# EAGLE design ltr-390uv-01-breakout (EAGLE 9.6.2)
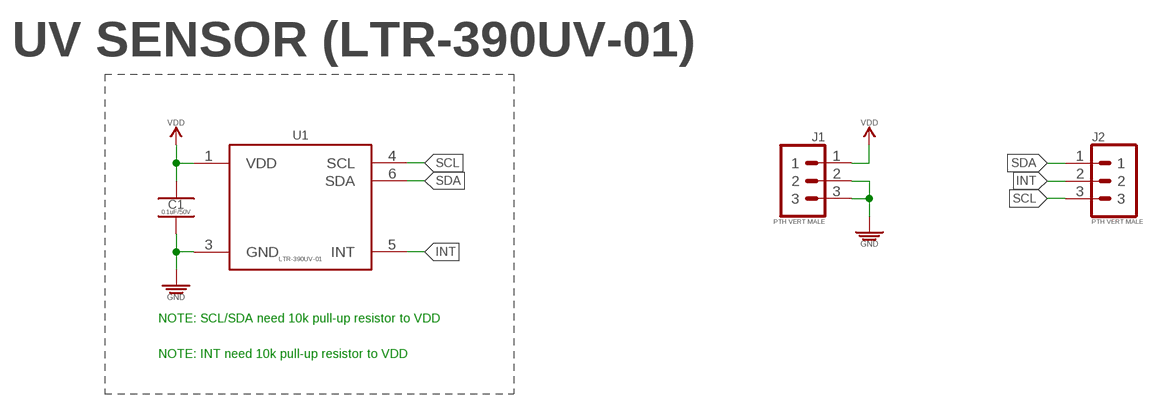
[diagram p0: schematic, sheet 1]

## Parts
C1  0.1uF/50V  0.1UF_SMD-0402_50V-10%  [CAPC1005X55_SMD-0402]
J1  PTH VERT MALE  1X03_PTH_VERT_MALE_2.54MM  [HDRV3W64P254_1X3_762X254X838B]
J2  PTH VERT MALE  1X03_PTH_VERT_MALE_2.54MM  [HDRV3W64P254_1X3_762X254X838B]
U1  LTR-390UV-01  [SON65P200X200X70-6N-LTR-390UV-01]

## Nets
GND: C1.2 J1.2 J1.3 U1.3(GND)
INT: J2.2 U1.5(INT)
SCL: J2.3 U1.4(SCL)
SDA: J2.1 U1.6(SDA)
VDD: C1.1 J1.1 U1.1(VDD)

## Notes on the sheet
- UV SENSOR (LTR-390UV-01)
- NOTE: SCL/SDA need 10k pull-up resistor to VDD
- NOTE: INT need 10k pull-up resistor to VDD

## Library data of the parts
C1 = _capacitors:0.1UF; DATASHEET: https://product.tdk.com/info/en/catalog/datasheets/mlcc_commercial_soft_en.pdf; DIST: Digikey; DISTLINK: https://www.digikey.com/products/en?keywords=445-173610-1-ND; DISTPN: 445-173610-1-ND; MFR: TDK Corporation; MPN: C1005X7R1H104K050BE
J1 J2 = _connectors:1X03; DATASHEET: https://s3.amazonaws.com/catalogspreads-pdf/PAGE112-113%20.100%20MALE%20HDR.pdf; DIST: Digikey; DISTLINK: https://www.digikey.com/en/products/detail/sullins-connector-solutions/PEC03SAAN/859156?s=N4IgTCBcDaIMoEYAMCwFEC0SDMGByAIiALoC%2BQA; DISTPN: S1012E-03-ND; MFR: Sullins Connector Solutions; MPN: PEC03SAAN
U1 = _sensors:LTR-390UV-01: SENSOR OPT ULTRAVIOLET 6PINS Optical Sensor Ultraviolet (UV) I²C 6-WFDFN; DATASHEET: https://optoelectronics.liteon.com/upload/download/DS86-2015-0004/LTR-390UV_Final_%20DS_V1%201.pdf; DIST: Digikey; DISTLINK: https://www.digikey.com/en/products/detail/lite-on-inc/LTR-390UV-01/7322497?s=N4IgTCBcDaIDIBUBKBaAzATgAwFUBqKWAjCgHIAiIAugL5A; DISTPN: LTR-390UV-01-ND; MFR: Lite-On Inc.; MPN: LTR-390UV-01

## Board
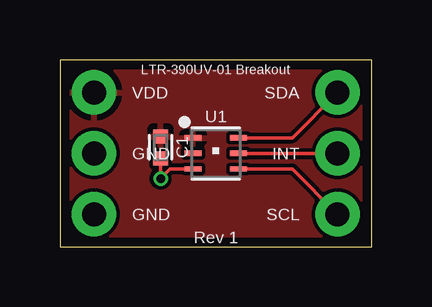
[diagram p1: board, top side]
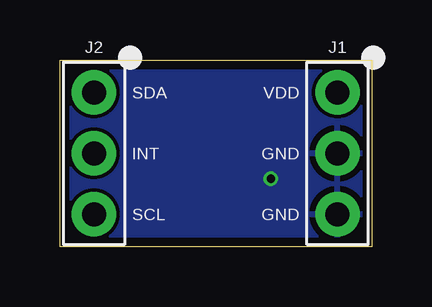
[diagram p2: board, bottom side, seen from below]

Size 13 x 7.8 mm. Coordinates in mm from the lower left corner, seen from the top.
Outline: 0,0 13,0 13,7.8 0,7.8 0,0
Copper layers (1*16): Top 0.035559375mm / dielectric 1.6mm / Bottom 0.035559375mm
Design rules "oshpark-2layer": minimum track width 6mil, minimum drill 10mil, track to track 6mil, track to pad 6mil, pad to pad 6mil, via to via 6mil, smd to smd 6mil, copper to edge 15mil, drill to drill 6mil, minimum pad ring 5mil, minimum via ring 5mil, stop-mask expansion 2.5mil, vias tented up to drill 0mil, thermal gap 10mil

### Footprints (pad centres in the part's own frame; a part is rotated, then mirrored left to right if it is on the bottom)
CAPC1005X55_SMD-0402 = smd 0.585 x 0.612: 1 -0.458,0; 2 0.458,0
HDRV3W64P254_1X3_762X254X838B = drill 1 pad 1.85: 1 -2.54,0; 2 0,0; 3 2.54,0
SON65P200X200X70-6N-LTR-390UV-01 = smd 0.7 x 0.22: 1 -0.95,0.65; 2 -0.95,0; 3 -0.95,-0.65; 4 0.95,-0.65; 5 0.95,0; 6 0.95,0.65

### Placement (x,y rotation side)
C1  4.2,4.15 270 top
J1  1.42,3.9 270 bottom
J2  11.58,3.9 270 bottom
U1  6.5,3.9 0 top

### Tracks (layer width: path | path; a pad name or v marks a point on that pad's centre or on a via)
GND  (via drill 0.35 pad 0.15)
  Top 0.152: C1.2 v4.2,2.85 4.6,3.25 U1.3
  pour Bottom: 0,0 13,0 13,7.8 0,7.8
INT
  Top 0.152: U1.5 J2.2
SCL
  Top 0.152: U1.4 9.69,3.25 J2.3
SDA
  Top 0.152: U1.6 9.69,4.55 J2.1
VDD
  pour Top: 0,0 13,0 13,7.8 0,7.8

### Text on the board
tPlace: LTR-390UV-01 Breakout | VDD | SDA | GND | INT | GND | SCL | Rev 1
bPlace: VDD | SDA | GND | INT | GND | SCL